# EAGLE design Main_PCB_Sig_only (EAGLE 9.7.0)
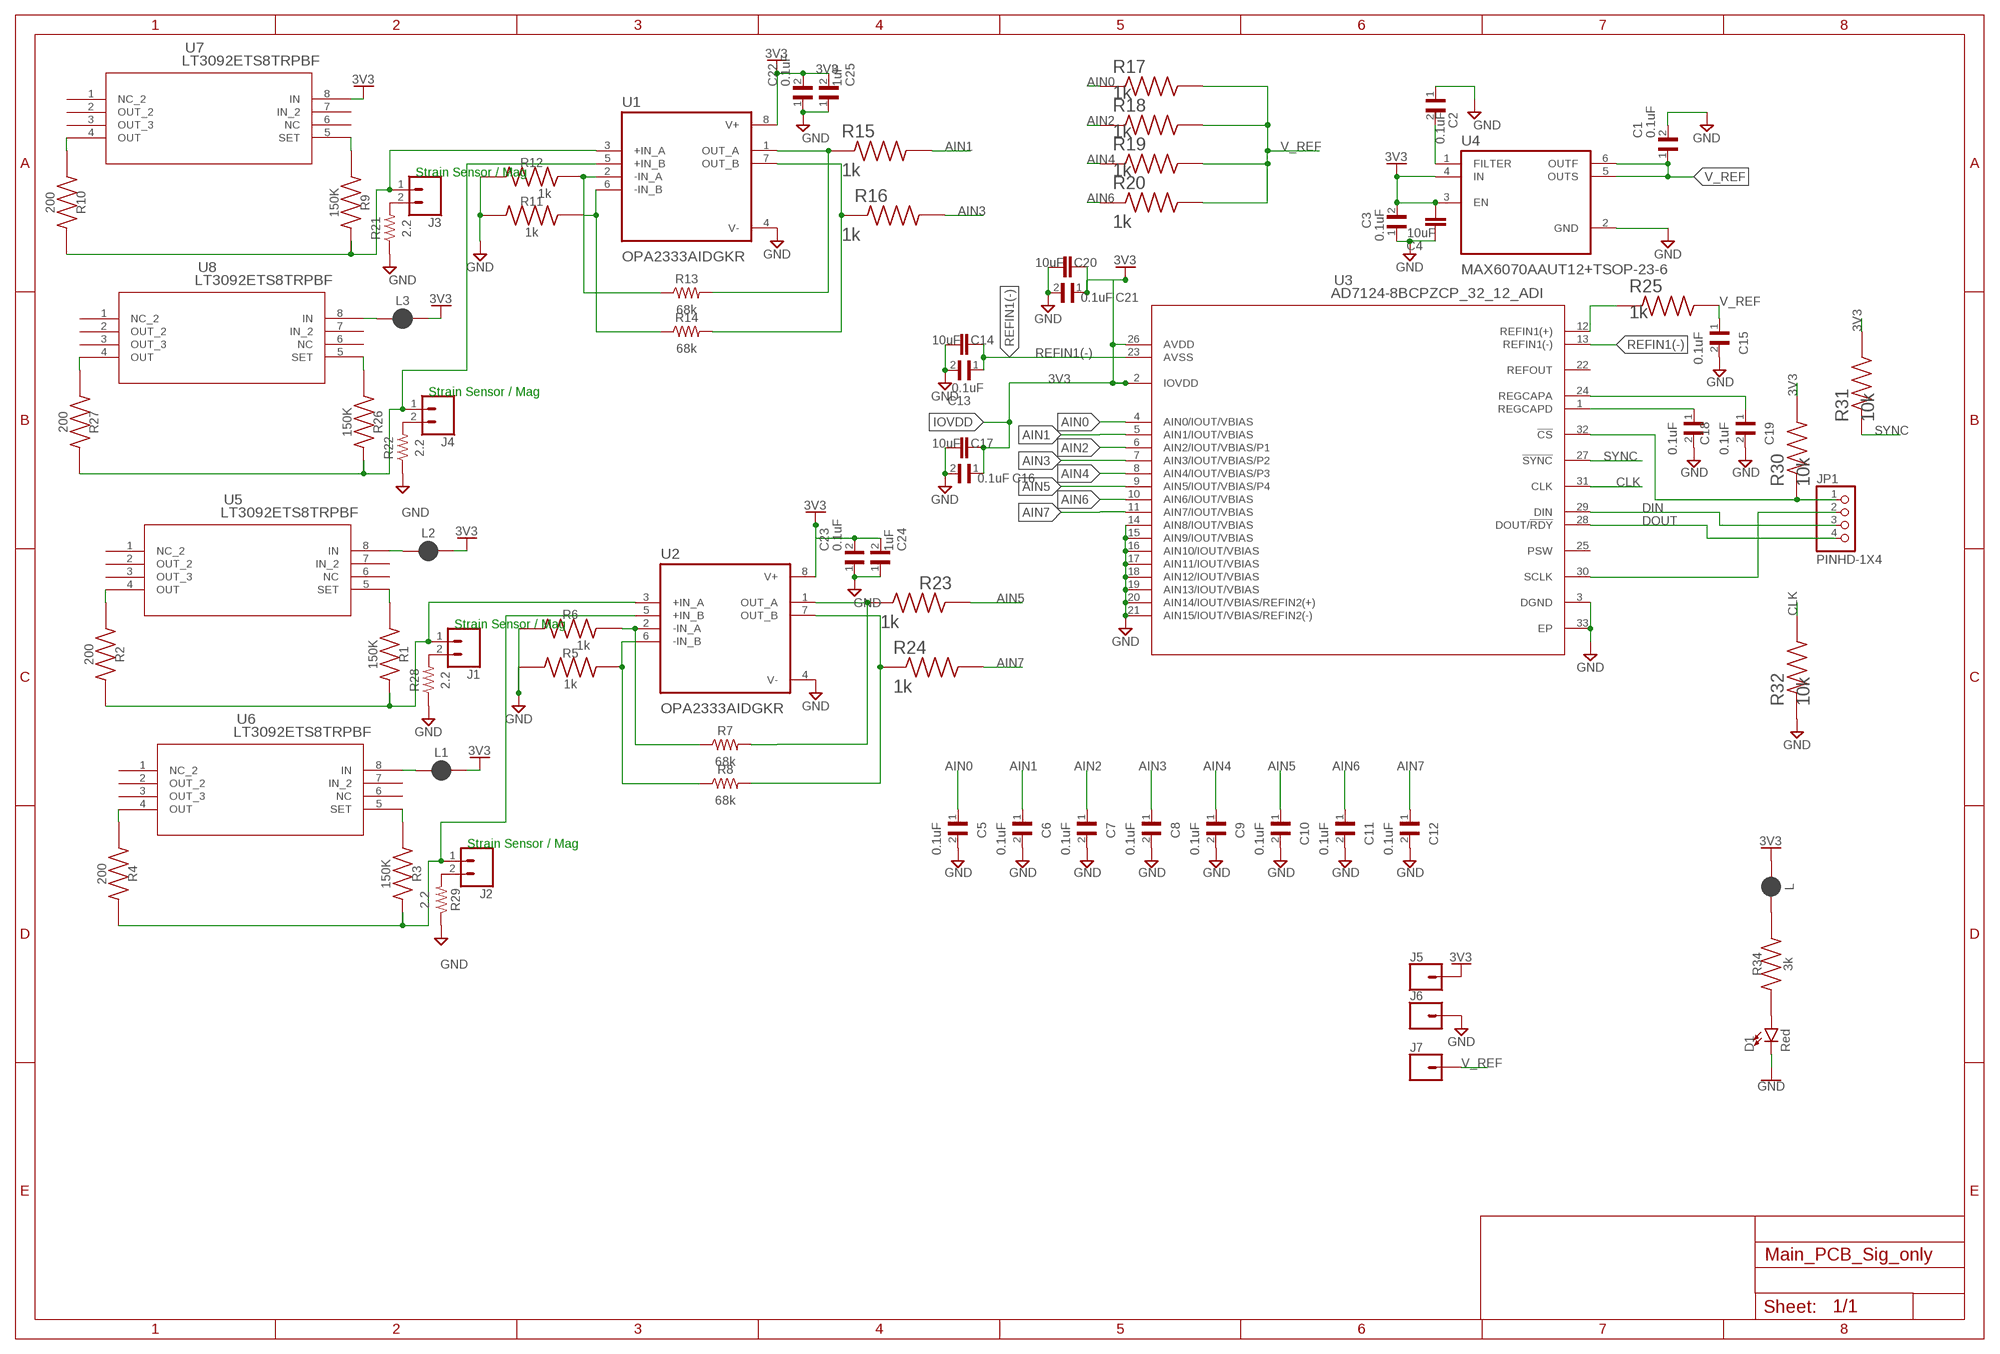
[diagram p0: schematic, sheet 1]

## Parts
C1  0.1uF  0201ZD104KAT2A  [CAPC0603X33N]
C2  0.1uF  0201ZD104KAT2A  [CAPC0603X33N]
C3  0.1uF  0201ZD104KAT2A  [CAPC0603X33N]
C4  10uF  C_CHIP-0402(1005-METRIC)  [CAPC1005X60]
C5  0.1uF  C0603X7S1A104M030BC0201  [CAPC0603X33N]
C6  0.1uF  C0603X7S1A104M030BC0201  [CAPC0603X33N]
C7  0.1uF  C0603X7S1A104M030BC0201  [CAPC0603X33N]
C8  0.1uF  C0603X7S1A104M030BC0201  [CAPC0603X33N]
C9  0.1uF  C0603X7S1A104M030BC0201  [CAPC0603X33N]
C10  0.1uF  C0603X7S1A104M030BC0201  [CAPC0603X33N]
C11  0.1uF  C0603X7S1A104M030BC0201  [CAPC0603X33N]
C12  0.1uF  C0603X7S1A104M030BC0201  [CAPC0603X33N]
C13  0.1uF  0201ZD104KAT2A  [CAPC0603X33N]
C14  10uF  C_CHIP-0402(1005-METRIC)  [CAPC1005X60]
C15  0.1uF  C0603X7S1A104M030BC0201  [CAPC0603X33N]
C16  0.1uF  0201ZD104KAT2A  [CAPC0603X33N]
C17  10uF  C_CHIP-0402(1005-METRIC)  [CAPC1005X60]
C18  0.1uF  C0603X7S1A104M030BC0201  [CAPC0603X33N]
C19  0.1uF  C0603X7S1A104M030BC0201  [CAPC0603X33N]
C20  10uF  C_CHIP-0402(1005-METRIC)  [CAPC1005X60]
C21  0.1uF  0201ZD104KAT2A  [CAPC0603X33N]
C22  0.1uF  0201ZD104KAT2A  [CAPC0603X33N]
C23  0.1uF  0201ZD104KAT2A  [CAPC0603X33N]
C24  1uF  0201ZD104KAT2A  [CAPC0603X33N]
C25  1uF  0201ZD104KAT2A  [CAPC0603X33N]
D1  Red  LED-RED0603  [LED-0603]
J1  CONN_02  [1X02]
J2  CONN_02  [1X02]
J3  CONN_02  [1X02]
J4  CONN_02  [1X02]
J5  CONN_01PTH_LONGPAD  [1X01_LONGPAD]
J6  CONN_01PTH_LONGPAD  [1X01_LONGPAD]
J7  CONN_01PTH_LONGPAD  [1X01_LONGPAD]
JP1  PINHD-1X4  [1X04]
L  JUMPER-SMT_2_NC_PASTE_NO-SILK  [SMT-JUMPER_2_NC_PASTE_NO-SILK]
L1  JUMPER-SMT_2_NC_PASTE_NO-SILK  [SMT-JUMPER_2_NC_PASTE_NO-SILK]
L2  JUMPER-SMT_2_NC_PASTE_NO-SILK  [SMT-JUMPER_2_NC_PASTE_NO-SILK]
L3  JUMPER-SMT_2_NC_PASTE_NO-SILK  [SMT-JUMPER_2_NC_PASTE_NO-SILK]
R1  150K  AC0201FR-0710KL  [RESC0603X26N]
R2  200  AC0201FR-0710KL  [RESC0603X26N]
R3  150K  AC0201FR-0710KL  [RESC0603X26N]
R4  200  AC0201FR-0710KL  [RESC0603X26N]
R5  1k  AC0201FR-0710KL  [RESC0603X26N]
R6  1k  AC0201FR-0710KL  [RESC0603X26N]
R7  68k  R-US_CHIP-0603(1608-METRIC)  [RESC1608X60]
R8  68k  R-US_CHIP-0603(1608-METRIC)  [RESC1608X60]
R9  150K  AC0201FR-0710KL  [RESC0603X26N]
R10  200  AC0201FR-0710KL  [RESC0603X26N]
R11  1k  AC0201FR-0710KL  [RESC0603X26N]
R12  1k  AC0201FR-0710KL  [RESC0603X26N]
R13  68k  R-US_CHIP-0603(1608-METRIC)  [RESC1608X60]
R14  68k  R-US_CHIP-0603(1608-METRIC)  [RESC1608X60]
R15  1k  AC0201FR-0710KL  [RESC0603X26N]
R16  1k  AC0201FR-0710KL  [RESC0603X26N]
R17  1k  AC0201FR-0710KL  [RESC0603X26N]
R18  1k  AC0201FR-0710KL  [RESC0603X26N]
R19  1k  AC0201FR-0710KL  [RESC0603X26N]
R20  1k  AC0201FR-0710KL  [RESC0603X26N]
R21  2.2  R-US_CHIP-0603(1608-METRIC)  [RESC1608X60]
R22  2.2  R-US_CHIP-0603(1608-METRIC)  [RESC1608X60]
R23  1k  AC0201FR-0710KL  [RESC0603X26N]
R24  1k  AC0201FR-0710KL  [RESC0603X26N]
R25  1k  AC0201FR-0710KL  [RESC0603X26N]
R26  150K  AC0201FR-0710KL  [RESC0603X26N]
R27  200  AC0201FR-0710KL  [RESC0603X26N]
R28  2.2  R-US_CHIP-0603(1608-METRIC)  [RESC1608X60]
R29  2.2  R-US_CHIP-0603(1608-METRIC)  [RESC1608X60]
R30  10k  AC0201FR-0710KL  [RESC0603X26N]
R31  10k  AC0201FR-0710KL  [RESC0603X26N]
R32  10k  AC0201FR-0710KL  [RESC0603X26N]
R34  3k  AC0201FR-0710KL  [RESC0603X26N]
U1  OPA2333AIDGKR  [SOP65P490X110-8N]
U2  OPA2333AIDGKR  [SOP65P490X110-8N]
U3  AD7124-8BCPZCP_32_12_ADI  [CP_32_12_ADI]
U4  MAX6070AAUT12+TSOP-23-6  [SOT95P280X145-6N]
U5  LT3092ETS8TRPBF  [TSOT-23_TS8]
U6  LT3092ETS8TRPBF  [TSOT-23_TS8]
U7  LT3092ETS8TRPBF  [TSOT-23_TS8]
U8  LT3092ETS8TRPBF  [TSOT-23_TS8]

## Nets
3V3: C3.2 C4.2 C16.1 C17.1 C20.1 C21.1 C22.2 C23.2 C24.2 C25.2 J5.1 L1.2 L2.2 L3.2 L.1 R30.2 R31.2 U1.8(V+) U2.8(V+) U3.2(IOVDD) U3.26(AVDD) U4.3(EN) U4.4(IN) U7.8(IN)
+IN_A1: J3.1 R9.2 R10.2 U1.3(+IN_A)
+IN_A2: J1.1 R1.2 R2.2 U2.3(+IN_A)
+IN_B1: J4.1 R26.2 R27.2 U1.5(+IN_B)
+IN_B2: J2.1 R3.2 R4.2 U2.5(+IN_B)
-IN_A1: R12.2 R13.1 U1.2(-IN_A)
-IN_A2: R6.2 R7.1 U2.2(-IN_A)
-IN_B1: R11.2 R14.1 U1.6(-IN_B)
-IN_B2: R5.2 R8.1 U2.6(-IN_B)
AIN0: C5.1 R17.1 U3.4(AIN0/IOUT/VBIAS)
AIN1: C6.1 R15.2 U3.5(AIN1/IOUT/VBIAS)
AIN2: C7.1 R18.1 U3.6(AIN2/IOUT/VBIAS/P1)
AIN3: C8.1 R16.2 U3.7(AIN3/IOUT/VBIAS/P2)
AIN4: C9.1 R19.1 U3.8(AIN4/IOUT/VBIAS/P3)
AIN5: C10.1 R23.2 U3.9(AIN5/IOUT/VBIAS/P4)
AIN6: C11.1 R20.1 U3.10(AIN6/IOUT/VBIAS)
AIN7: C12.1 R24.2 U3.11(AIN7/IOUT/VBIAS)
CLK: R32.2 U3.31(CLK)
CS: JP1.1 R30.1 U3.32(!CS)
DIN: JP1.3 U3.29(DIN)
DOUT: JP1.4 U3.28(DOUT/!RDY)
GND: C1.2 C2.1 C3.1 C4.1 C5.2 C6.2 C7.2 C8.2 C9.2 C10.2 C11.2 C12.2 C13.2 C14.2 C15.2 C16.2 C17.2 C18.2 C19.2 C20.2 C21.2 C22.1 C23.1 C24.1 C25.1 D1.C J6.1 R5.1 R6.1 R11.1 R12.1 R21.1 R22.1 R28.1 R29.1 R32.1 U1.4(V-) U2.4(V-) U3.3(DGND) U3.14(AIN8/IOUT/VBIAS) U3.15(AIN9/IOUT/VBIAS) U3.16(AIN10/IOUT/VBIAS) U3.17(AIN11/IOUT/VBIAS) U3.18(AIN12/IOUT/VBIAS) U3.19(AIN13/IOUT/VBIAS) U3.20(AIN14/IOUT/VBIAS/REFIN2(+)) U3.21(AIN15/IOUT/VBIAS/REFIN2(-)) U3.33(EP) U4.2(GND)
I_OUT1: R10.1 U7.4(OUT)
I_OUT2: R27.1 U8.4(OUT)
I_OUT3: R2.1 U5.4(OUT)
I_OUT4: R4.1 U6.4(OUT)
I_SET1: R9.1 U7.5(SET)
I_SET2: R26.1 U8.5(SET)
I_SET3: R1.1 U5.5(SET)
I_SET4: R3.1 U6.5(SET)
N$1: L1.1 U6.8(IN)
N$17: C2.2 U4.1(FILTER)
N$29: J3.2 R21.2
N$34: J4.2 R22.2
N$35: J1.2 R28.2
N$36: J2.2 R29.2
N$38: L.2 R34.2
N$39: D1.A R34.1
N$40: L2.1 U5.8(IN)
N$41: L3.1 U8.8(IN)
OUT_A1: R13.2 R15.1 U1.1(OUT_A)
OUT_A2: R7.2 R23.1 U2.1(OUT_A)
OUT_B1: R14.2 R16.1 U1.7(OUT_B)
OUT_B2: R8.2 R24.1 U2.7(OUT_B)
REFIN1(+): R25.1 U3.12(REFIN1(+))
REFIN1(-): C13.1 C14.1 U3.13(REFIN1(-)) U3.23(AVSS)
REGCAPA: C19.1 U3.24(REGCAPA)
REGCAPD: C18.1 U3.1(REGCAPD)
SCLK: JP1.2 U3.30(SCLK)
SYNC: R31.1 U3.27(!SYNC)
V_REF: C1.1 C15.1 J7.1 R17.2 R18.2 R19.2 R20.2 R25.2 U4.5(OUTS) U4.6(OUTF)
Unconnected: U3.22(REFOUT) U3.25(PSW) U5.1(NC_2) U5.2(OUT_2) U5.3(OUT_3) U5.6(NC) U5.7(IN_2) U6.1(NC_2) U6.2(OUT_2) U6.3(OUT_3) U6.6(NC) U6.7(IN_2) U7.1(NC_2) U7.2(OUT_2) U7.3(OUT_3) U7.6(NC) U7.7(IN_2) U8.1(NC_2) U8.2(OUT_2) U8.3(OUT_3) U8.6(NC) U8.7(IN_2)

## Notes on the sheet
- Strain Sensor / Mag
- Strain Sensor / Mag
- Strain Sensor / Mag
- Strain Sensor / Mag

## Library data of the parts
C1-C3 C13 C16 C21-C25 = Cap 0201ZD104KAT2A:0201ZD104KAT2A: Check availability <https://pricing.snapeda.com/parts/0201ZD104KAT2A/AVX/view-part?ref=eda>; AVAILABILITY: In Stock; CHECK_PRICES: https://www.snapeda.com/parts/0201ZD104KAT2A/AVX/view-part/?ref=eda; DESCRIPTION: 0.1 µF ±10% 10V Ceramic Capacitor X5R 0201 (0603 Metric); MF: AVX; MP: 0201ZD104KAT2A; PACKAGE: 0603 AVX; PRICE: None; SNAPEDA_LINK: https://www.snapeda.com/parts/0201ZD104KAT2A/AVX/view-part/?ref=snap
C4 C14 C17 C20 = Capacitor:C: Capacitor - Generic; CATEGORY: Capacitor
C5-C12 C15 C18 C19 = Cap 0201:C0603X7S1A104M030BC: Check availability <https://pricing.snapeda.com/parts/C0603X7S1A104M030BC/TDK/view-part?ref=eda>; AVAILABILITY: In Stock; CHECK_PRICES: https://www.snapeda.com/parts/C0603X7S1A104M030BC/TDK/view-part/?ref=eda; DESCRIPTION: 0.1 µF ±20% 10V Ceramic Capacitor X7S 0201 (0603 Metric); MF: TDK; MP: C0603X7S1A104M030BC; PACKAGE: 0603 Taiyo Yuden; PRICE: None; SNAPEDA_LINK: https://www.snapeda.com/parts/C0603X7S1A104M030BC/TDK/view-part/?ref=snap
D1 = SparkFun-LED:LED-RED: Red SMD LED Used in manufacturing of most products at SparkFun Packages: 0603 - KB - KingBright (DIO-17976) SMD 0603 package [Datasheet] <https://www.kingbrightusa.com/images/catalog/SPEC/APT1608SURCK.pdf> 0603 - (DIO-00819, has gone EOL) SMD 0603 package 0603 SMART - SMD 0603 SMART package ( more efficient and expensive)[Product Link] <http://www.osram-os.com/Graphics/XPic2/00077099_0.pdf> 1206 - SMD1206 package [Product Link] <https://www.sparkfun.com/datasheets/DevTools/LilyPad/Q150OVS4.pdff> SparkFun Products: Pro Mini 328 -5V <https://www.sparkfun.com/products/821> RedBoard <https://www.sparkfun.com/products/12757> IOIO-OTG <https://www.sparkfun.com/products/13613>; PROD_ID: DIO-00819
J1-J4 = SparkFun-Connectors:CONN_02: Multi connection point. Often used as Generic Header-pin footprint for 0.1 inch spaced/style header connections On any of the 0.1 inch spaced packages, you can populate with these: Break Away Headers - Straight <https://www.sparkfun.com/products/116> (PRT-00116) Break Away Male Headers - Right Angle <https://www.sparkfun.com/products/553> (PRT-00553) Female Headers <https://www.sparkfun.com/products/115> (PRT-00115) Break Away Headers - Machine Pin <https://www.sparkfun.com/products/117> (PRT-00117) Break Away Female Headers - Swiss Machine Pin <https://www.sparkfun.com/products/743> (PRT-00743) For SCREWTERMINALS and SPRING TERMINALS visit here: Screw Terimnals on SparkFun.com <https://www.sparkfun.com/search/results?term=Screw+Terminals> (5mm/3.5mm/2.54mm spacing) This device is also useful as a general connection point to wire up your design to another part of your project. Our various solder wires solder well into these plated through hole pads. Hook-Up Wire - Assortment (Stranded, 22 AWG) <https://www.sparkfun.com/products/11375> (PRT-11375) Hook-Up Wire - Assortment (Solid Core, 22 AWG) <https://www.sparkfun.com/products/11367> (PRT-11367) View the entire wire category on our website here <https://www.sparkfun.com/categories/141> Special notes: Molex polarized connector foot print use with: PRT-08233 with associated crimp pins and housings. 2.54_SCREWTERM for use with PRT-10571. 3.5mm Screw Terminal footprints for PRT-08084 5mm Screw Terminal footprints for use with PRT-08432
J5-J7 = SparkFun-Connectors:CONN_01: Single connection point. Often used as Generic Header-pin footprint for 0.1 inch spaced/style header connections On any of the 0.1 inch spaced packages, you can populate with these: Break Away Headers - Straight <https://www.sparkfun.com/products/116> (PRT-00116) Break Away Male Headers - Right Angle <https://www.sparkfun.com/products/553> (PRT-00553) Female Headers <https://www.sparkfun.com/products/115> (PRT-00115) Break Away Headers - Machine Pin <https://www.sparkfun.com/products/117> (PRT-00117) Break Away Female Headers - Swiss Machine Pin <https://www.sparkfun.com/products/743> (PRT-00743) This device is also useful as a general connection point to wire up your design to another part of your project. Our various solder wires solder well into these plated through hole pads. Hook-Up Wire - Assortment (Stranded, 22 AWG) <https://www.sparkfun.com/products/11375> (PRT-11375) Hook-Up Wire - Assortment (Solid Core, 22 AWG) <https://www.sparkfun.com/products/11367> (PRT-11367) View the entire wire category on our website here <https://www.sparkfun.com/categories/141> Special notes: SMTSO-256-ET is a "flush mount" nut for a 4-40 screw. We mostly use this on specialty testbeds; it is a nice way to connect hardware to your PCB at an adjustable hieght. Also note, the SNAP packages are for using a snappable style connector. We sell a baggie of snaps and they are also used on two LilyPad designs: Snap Assortment - 30 pack (male and female) <https://www.sparkfun.com/products/11347> (DEV-11347) LilyPad Arduino SimpleSnap <https://www.sparkfun.com/products/10941> (DEV-10941) LilyPad SimpleSnap Protoboard <https://www.sparkfun.com/products/10940> (DEV-10940)
JP1 = Connector:PINHD-1X4: PIN HEADER; CATEGORY: Headers; DESCRIPTION: Header, Straight, 4 Position; MANUFACTURER: Generic; MPN: Generic; OPERATING_TEMPERATURE: Generic; PART_STATUS: Active; PITCH: 0.100" (2.54mm); ROHS_COMPLIANCE: Generic; SERIES: Generic; SUB-CATEGORY: Headers, Male Pins; TYPE: Board to Board or Cable, Unshrouded, Through Hole, Straight
L L1-L3 = SparkFun-Jumpers-KinGlove-Addr-Custom:JUMPER-SMT_2_NC_PASTE: Normally closed solder jumper This jumper has an aperture in the stencil to allow solder paste to bridge the split in the wire so it's normally closed (NC). Wick off the solder to open the connection. Reapply solder to reclose the connection.
R1-R6 R9-R12 R15-R20 R23-R27 R30-R32 R34 = Resistor 0201 (0603 Metric) AC0201FR-0710KL:AC0201FR-0710KL: Check availability <https://pricing.snapeda.com/parts/AC0201FR-0710KL/Yageo/view-part?ref=eda>; AVAILABILITY: In Stock; CHECK_PRICES: https://www.snapeda.com/parts/AC0201FR-0710KL/Yageo/view-part/?ref=eda; DESCRIPTION: 10 kOhms ±1% 0.05W, 1/20W Chip Resistor 0201 (0603 Metric) Automotive AEC-Q200, Moisture Resistant Thick Film; MF: Yageo; MP: AC0201FR-0710KL; PACKAGE: SMD-2 Yageo; PRICE: None; SNAPEDA_LINK: https://www.snapeda.com/parts/AC0201FR-0710KL/Yageo/view-part/?ref=snap
R7 R8 R13 R14 R21 R22 R28 R29 = Resistor:R-US: Resistor Fixed - ANSI; CATEGORY: Resistor; SUB-CATEGORY: Fixed
U1 U2 = OPA2333AIDGKR:OPA2333AIDGKR: Check availability <https://pricing.snapeda.com/parts/OPA2333AIDGKR/Texas%20Instruments/view-part?ref=eda>; AVAILABILITY: In Stock; CHECK_PRICES: https://www.snapeda.com/parts/OPA2333AIDGKR/Texas+Instruments/view-part/?ref=eda; DESCRIPTION: 1.8-V, 17-µA, two-channel, micropower zero-drift CMOS operational amplifier; MF: Texas Instruments; MP: OPA2333AIDGKR; PACKAGE: VSSOP-8 Texas Instruments; PRICE: None; SNAPEDA_LINK: https://www.snapeda.com/parts/OPA2333AIDGKR/Texas+Instruments/view-part/?ref=snap
U3 = 2025-08-13_20-53-36_Library:AD7124-8BCPZ; COPYRIGHT: Copyright (C) 2025 Ultra Librarian. All rights reserved.; DATASHEET: https://www.analog.com/media/en/technical-documentation/data-sheets/ad7124-8.pdf; DESCRIPTION: 8-Channel, Low Noise, Low Power, 24-Bit, Sigma-Delta ADC with PGA and Reference; MANUFACTURER_NAME: Analog Devices Inc; MANUFACTURER_PART_NUMBER: AD7124-8BCPZ
U4 = MAX6070AAUT12_T:MAX6070AAUT12+T: Check availability <https://pricing.snapeda.com/parts/MAX6070AAUT12%2BT/Maxim%20Integrated%20Products/view-part?ref=eda>; AVAILABILITY: In Stock; CHECK_PRICES: https://www.snapeda.com/parts/MAX6070AAUT12+T/Maxim+Integrated/view-part/?ref=eda; DESCRIPTION: Series Voltage Reference IC Fixed 1.25V V ±0.04% 10 mA SOT-23-6; MF: Maxim Integrated Products; MP: MAX6070AAUT12+T; PACKAGE: SOT-23-6 Maxim Integrated; PRICE: None; SNAPEDA_LINK: https://www.snapeda.com/parts/MAX6070AAUT12+T/Maxim+Integrated/view-part/?ref=snap
U5-U8 = LT3092ETS8TRPBF:LT3092ETS8TRPBF: Check availability <https://pricing.snapeda.com/parts/LT3092ETS8%23TRPBF/Analog%20Devices/view-part?ref=eda>; AVAILABILITY: In Stock; CHECK_PRICES: https://www.snapeda.com/parts/LT3092ETS8%23TRPBF/Analog+Devices/view-part/?ref=eda; DESCRIPTION: 200mA 2-Terminal Programmable Current Source; MF: Analog Devices; MP: LT3092ETS8#TRPBF; PACKAGE: TSOT-23 Linear Technology; PRICE: None; SNAPEDA_LINK: https://www.snapeda.com/parts/LT3092ETS8%23TRPBF/Analog+Devices/view-part/?ref=snap

## Board
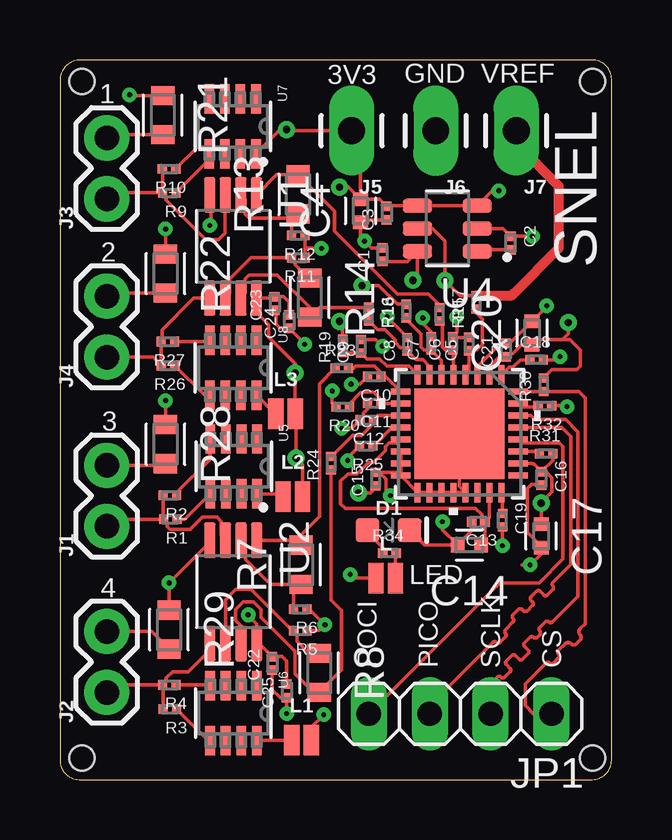
[diagram p1: board, top side]
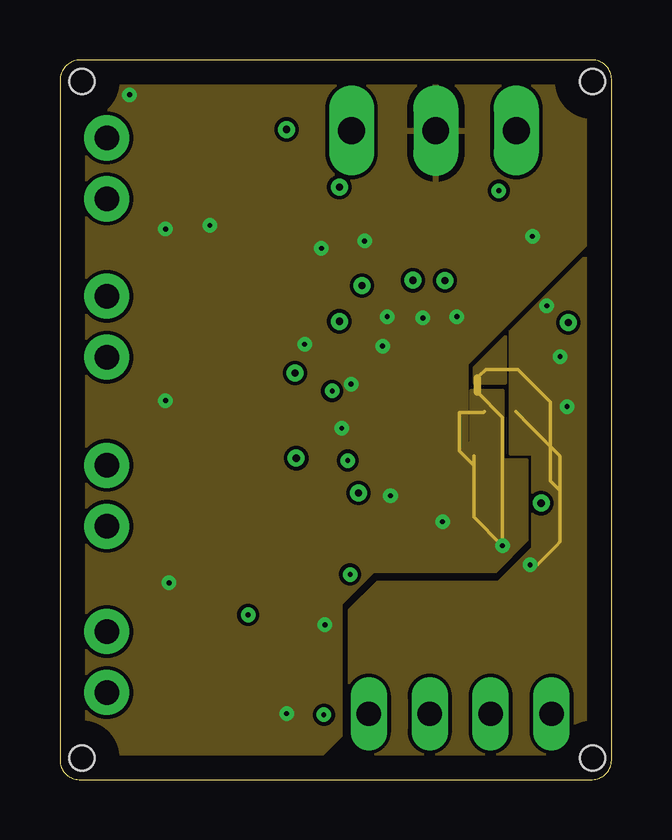
[diagram p2: board, inner layer Route2]
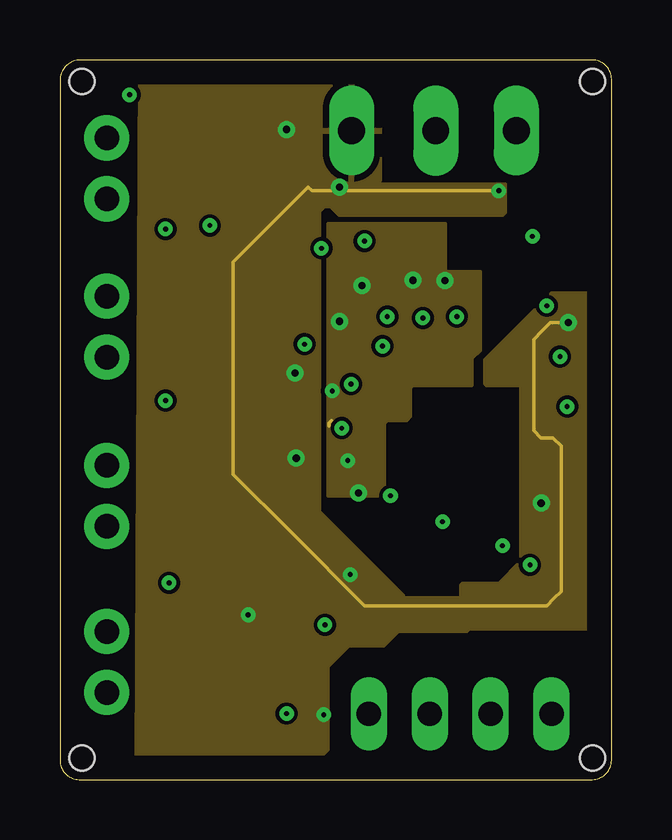
[diagram p3: board, inner layer Route15]
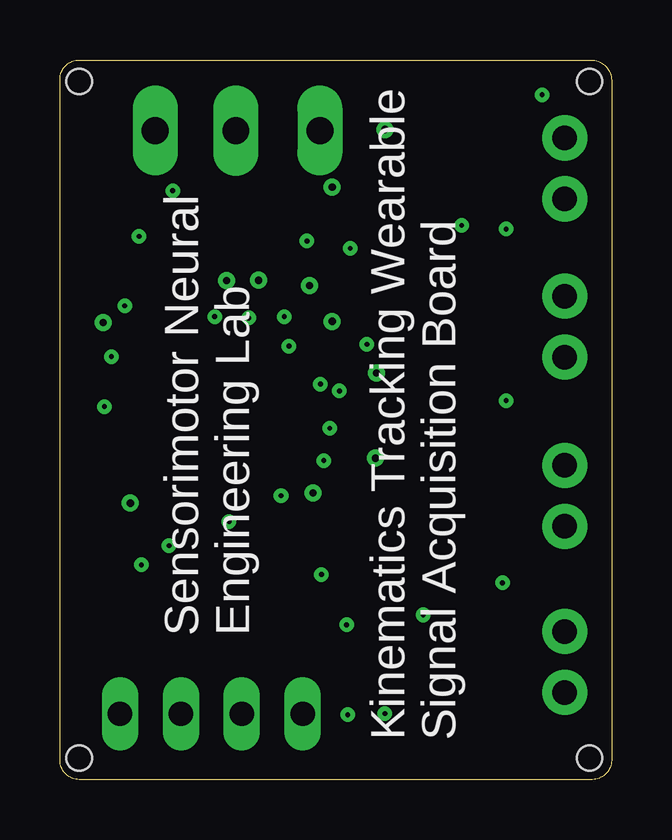
[diagram p4: board, bottom side, seen from below]

Size 23 x 30 mm. Coordinates in mm from the lower left corner, seen from the top.
Outline: 0,1.25 0,0.8 arc90 0.8,0 1.15,0 2.15,0 2.25,0 22.2,0 arc90 23,0.8 23,0.95 23,27.2 23,28.45 23,29.2 arc90 22.2,30 21.9,30 1.3,30 0.85,30 arc90 0,29.15 0,28.85 0,28.8 0,1.25
Copper layers (1+2*15+16): Top 0.035mm / dielectric 1.5mm / Route2 0.035mm / dielectric 0.15mm / Route15 0.035mm / dielectric 0.2mm / Bottom 0.035mm
Design rules "Fusion Electronics Design Rules *": minimum track width 6mil, minimum drill 0.15mm, track to track 6mil, track to pad 6mil, pad to pad 6mil, via to via 6mil, smd to smd 6mil, copper to edge 40mil, drill to drill 6mil, minimum pad ring 10mil, minimum via ring 8mil, stop-mask expansion 4mil, vias tented up to drill 9999mil, thermal gap 10mil
Holes 1.05 mm at 22.2,0.9 0.93,29.1 22.2,29.1 0.93,0.9

### Footprints (pad centres in the part's own frame; a part is rotated, then mirrored left to right if it is on the bottom)
CAPC0603X33N = smd 0.4 x 0.42: 1 -0.28,0; 2 0.28,0
CAPC1005X60 = smd 0.56 x 0.629: 1 -0.485,0; 2 0.485,0
CAPC0603X33N' = smd 0.38 x 0.4: 1 -0.281,0; 2 0.281,0
LED-0603 = smd 1 x 1: A -0.877,0; C 0.877,0
1X02 = drill 1.016 pad 1.88: 1 0,0; 2 2.54,0
1X01_LONGPAD = drill 1.118 pad 1.88 long: 1 0,0
1X04 = drill 1.016 long: 1 -3.81,0; 2 -1.27,0; 3 1.27,0; 4 3.81,0
SMT-JUMPER_2_NC_PASTE_NO-SILK = smd 0.635 x 1.27: 1 -0.406,0; 2 0.406,0
RESC0603X26N = smd 0.38 x 0.4: 1 -0.281,0; 2 0.281,0
RESC1608X60 = smd 0.799 x 0.974: 1 -0.815,0; 2 0.815,0
SOP65P490X110-8N = smd 1.47 x 0.48: 1 -2.15,0.975; 2 -2.15,0.325; 3 -2.15,-0.325; 4 -2.15,-0.975; 5 2.15,-0.975; 6 2.15,-0.325; 7 2.15,0.325; 8 2.15,0.975
CP_32_12_ADI = smd 0.813 x 0.254: 1 -2.451,1.75; 2 -2.451,1.25; 3 -2.451,0.75; 4 -2.451,0.25; 5 -2.451,-0.25; 6 -2.451,-0.75; 7 -2.451,-1.25; 8 -2.451,-1.75; 17 2.451,-1.75; 18 2.451,-1.25; 19 2.451,-0.75; 20 2.451,-0.25; 21 2.451,0.25; 22 2.451,0.75; 23 2.451,1.25; 24 2.451,1.75 | smd 0.254 x 0.813: 9 -1.75,-2.451; 10 -1.25,-2.451; 11 -0.75,-2.451; 12 -0.25,-2.451; 13 0.25,-2.451; 14 0.75,-2.451; 15 1.25,-2.451; 16 1.75,-2.451; 25 1.75,2.451; 26 1.25,2.451; 27 0.75,2.451; 28 0.25,2.451; 29 -0.25,2.451; 30 -0.75,2.451; 31 -1.25,2.451; 32 -1.75,2.451 | smd 3.759 x 3.759: 33 0,0
SOT95P280X145-6N = smd 1.22 x 0.6: 1 -1.245,0.95; 2 -1.245,0; 3 -1.245,-0.95; 4 1.245,-0.95; 5 1.245,0; 6 1.245,0.95
TSOT-23_TS8 = smd 1.219 x 0.406: 1 -1.143,0.975; 2 -1.143,0.325; 3 -1.143,-0.325; 4 -1.143,-0.975; 5 1.143,-0.975; 6 1.143,-0.325; 7 1.143,0.325; 8 1.143,0.975

### Placement (x,y rotation side)
C1  13.44,21.88 90 top
C2  18.79,22.37 270 top
C3  13.62,23.61 90 top
C4  12.53,23.71 90 top
C5  0.1uF  [CAPC0603X33N']  17.05,18.16 90 top
C6  0.1uF  [CAPC0603X33N']  16.38,18.18 90 top
C7  0.1uF  [CAPC0603X33N']  15.48,18.19 90 top
C8  0.1uF  [CAPC0603X33N']  14.48,18.15 90 top
C9  0.1uF  [CAPC0603X33N']  12.55,18.07 90 top
C10  0.1uF  [CAPC0603X33N']  13.11,16.8 180 top
C11  0.1uF  [CAPC0603X33N']  13.1,15.7 180 top
C12  0.1uF  [CAPC0603X33N']  12.8,14.99 180 top
C13  17.44,10.74 180 top
C14  17.07,9.78 180 top
C15  0.1uF  [CAPC0603X33N']  13.15,12.52 90 top
C16  20.08,12.55 270 top
C17  20.06,10.16 270 top
C18  0.1uF  [CAPC0603X33N']  19.88,17.5 0 top
C19  0.1uF  [CAPC0603X33N']  18.45,10.81 270 top
C20  19.68,18.62 90 top
C21  18.59,17.91 90 top
C22  8.85,4.85 90 top
C23  8.95,19.85 90 top
C24  9.55,19.1 90 top
C25  9.45,3.7 90 top
D1  13.7,10.39 0 top
J1  1.96,10.56 90 top
J2  1.96,3.63 90 top
J3  1.96,24.21 90 top
J4  1.96,17.61 90 top
J5  12.16,27.05 180 top
J6  15.67,27.05 180 top
J7  19.03,27.05 180 top
JP1  16.69,2.74 180 top
L  13.58,8.4 0 top
L1  10.07,1.65 0 top
L2  9.71,11.8 0 top
L3  9.41,15.25 0 top
R1  4.6,10.85 180 top
R2  4.59,11.85 180 top
R3  4.58,2.93 180 top
R4  4.57,3.95 180 top
R5  10.03,6.21 180 top
R6  10.02,7.11 180 top
R7  10.05,8.95 90 top
R8  10.81,4.45 270 top
R9  4.56,24.46 180 top
R10  4.55,25.46 180 top
R11  9.94,21.76 180 top
R12  9.93,22.68 180 top
R13  9.93,24.4 90 top
R14  10.42,20.1 270 top
R15  15.83,19.39 270 top
R16  12.88,19.41 270 top
R17  17.35,19.9 90 top
R18  14.43,19.53 90 top
R19  11.79,18.08 90 top
R20  11.79,15.54 180 top
R21  4.29,27.7 270 top
R22  4.4,21.09 270 top
R23  11.75,17.15 0 top
R24  11.3,13.18 90 top
R25  12.77,13.91 180 top
R26  4.51,17.26 180 top
R27  4.5,18.26 180 top
R28  4.4,13.98 270 top
R29  4.55,6.25 270 top
R30  20.16,16.46 90 top
R31  20.27,13.59 0 top
R32  20.22,15.59 180 top
R34  13.74,9.44 0 top
U1  7.22,22.22 270 top
U2  7.23,7.82 270 top
U3  16.66,14.42 270 top
U4  16.15,22.97 180 top
U5  7.25,13.06 270 top
U6  7.23,2.77 270 top
U7  7.2,27.23 270 top
U8  7.22,17.17 270 top

### Tracks (layer width: path | path; a pad name or v marks a point on that pad's centre or on a via)
3V3  (via drill 0.2, 0.3)
  Top 0.152: U3.2 17.91,17.23 18.19,17.51 18.31,17.63 C21.1 18.72,17.76 18.89,17.76 19.27,18.13 C20.1 19.9,18.35 20.75,18.35 20.95,18.35 | C16.1 19.75,13.16 19.7,13.16 19.7,13.17 U3.26 | R30.2 20.52,17.1 21.55,17.1 21.7,17.25 21.7,17.6 21.7,17.9 21.25,18.35 20.95,18.35 | 20.95,18.35 21.2,18.6 v21.2,19.05 | C17.1 v20.07,11.53 20.52,11.98 20.52,12.57 20.25,12.83 C16.1 | 9.5,27.1 9.55,27.05 J5.1 12.53,26.68 C4.2 | 9.5,27.1 v9.45,27.1 | U7.8 9.19,27.1 9.5,27.1 | C4.2 13.31,24.2 C3.2 13.65,23.92 U4.4 U4.3 18.03,24.55 v18.3,24.55 | C4.2 12.03,24.7 v11.65,24.7 | L2.2 10.12,13.13 v9.85,13.4 9.85,15.21 L3.2 9.8,15.27 v9.8,16.95 9.8,17.35 8.7,18.45 8.7,18.85 8.7,18.97 8.19,19.47 U1.8 8.89,20.07 C23.2 9.32,20.13 9.5,19.95 9.55,19.9 C24.2 | v7.85,6.87 v7.85,6.85 8.2,6.5 U2.8 8.31,5.67 C22.2 9.27,5.13 9.4,5 9.45,4.95 C25.2 | L1.2 10.48,2.17 v11,2.7 | L.1 12.25,8.4 v12.1,8.55 | C16.1 20.55,13.3 R31.2
  Route15 0.152: v18.3,24.55 10.5,24.55 10.35,24.7 7.22,21.57 7.22,12.72 9.65,10.3 12.7,7.25 13.55,7.25 20.3,7.25 20.6,7.55 20.9,7.85 20.9,13.9 20.55,14.25 20.05,14.25 19.75,14.55 19.75,16.85 19.75,18.35 20.1,18.7 20.45,19.05 v21.2,19.05
  pour Route15: 18.57,24.82 18.57,24.82 13.38,24.82 13.36,24.84 13.34,24.86 13.32,24.88 13.32,24.92 13.34,24.94 13.37,24.98 13.37,29.72 3.33,29.72 3.18,0.73 10.67,0.73 11.17,1.23 11.17,4.67 11.19,4.69 12.06,5.56 12.08,5.58 13.52,5.58 14.32,6.38 14.32,7.67 10.84,11.16 10.82,11.18 10.82,23.67 10.84,23.69 11.01,23.86 11.03,23.88 11.27,23.88 11.29,23.86 11.63,23.53 18.47,23.53 18.57,23.63
  pour Route15: 19.21,9.11 18.29,8.19 18.27,8.17 16.78,8.17 16.73,8.12 16.73,6.28 21.97,6.28 21.97,20.27 20.48,20.27 17.73,17.52 17.73,16.48 17.78,16.43 19.17,16.43 19.19,16.41 19.21,16.39 19.23,16.37 19.23,9.13
  pour Route15: 14.03,6.18 16.97,6.18 17.02,6.23 17.02,7.52 16.97,7.57 14.03,7.57
+IN_A1
  Top 0.152: R10.2 R9.2 | R9.2 2.21,24.46 J3.1 | R9.2 4.42,24.32 4.42,24.16 6.07,22.52 6.62,22.52 6.89,22.79 U1.3
+IN_A2
  Top 0.152: J1.1 2.25,10.85 4.3,10.85 | 4.3,10.85 R1.2 4.46,10.71 4.46,10.55 4.6,10.42 5.44,10.42 5.95,10.94 6.55,10.94 6.72,10.77 6.72,10.16 U2.3 | R2.2 R1.2 4.3,10.85
+IN_B1
  Top 0.152: J4.1 3.88,17.61 R26.2 | R26.2 | R26.2 R27.2 4.25,18.29 4.25,18.75 5.57,20.07 U1.5
+IN_B2
  Top 0.152: J2.1 2.27,3.95 R4.2 | R4.2 R3.2 | R4.2 4.43,4.09 4.43,4.25 4.69,4.5 5.35,4.5 6.25,5.4 U2.5
-IN_A1
  Top 0.152: U1.2 7.72,24.19 7.72,23.58 7.89,23.41 9.93,23.41 R13.1 9.65,23.31 R12.2
-IN_A2
  Top 0.152: R6.2 9.74,7.83 R7.1 8.78,8.14 7.73,9.18 7.73,9.79 U2.2
-IN_B1
  Top 0.152: 7.07,20.26 U1.6 7.07,20.26 | 7.07,20.26 7.07,20.87 7.97,21.76 R11.2 9.8,21.62 9.8,21.46 10.36,20.91 R14.1
-IN_B2
  Top 0.152: U2.6 6.9,7.5 7.33,7.93 7.97,7.93 9.69,6.21 R5.2 9.89,6.07 9.89,5.77 10.39,5.26 R8.1
AIN0
  Top 0.152: U3.4 17.05,17.02 C5.1 17.09,17.92 17.39,17.92 17.61,18.14 17.61,19.21 17.35,19.47 R17.1 17.35,19.45
AIN1
  Top 0.152: U3.5 16.41,17.87 C6.1 16.09,17.9 16.08,17.9 15.95,18.03 15.95,18.99 R15.2
AIN2
  Top 0.152: U3.6 15.91,17.47 C7.1 15.18,17.9 15.05,18.04 15.05,18.58 14.43,19.19 R18.1
AIN3
  Top 0.152: U3.7 15.41,17.23 15.13,17.51 14.85,17.51 C8.1 14.34,18.01 14.19,18.01 13.98,18.22 13.98,18.33 13.54,18.77 13.24,18.77 R16.2
AIN4
  Top 0.152: R19.1 11.8,17.79 C9.1 12.8,17.54 13.33,17.54 13.64,17.23 14.55,17.23 U3.8
AIN5
  Top 0.152: 13.55,16.8 C10.1 | 13.55,16.8 13.58,16.8 U3.9 | R23.2 12.25,17.15 12.33,17.23 13.12,17.23 13.55,16.8
AIN6
  Top 0.152: U3.10 13.41,15.67 C11.1 13.38,15.85 13.08,16.15 12.65,16.15 12.63,16.13 12.53,16.13 12.07,15.66 R20.1
AIN7
  Top 0.152: 12.97,14.9 13.24,15.17 U3.11 | 12.97,14.9 13.06,14.99 | 13.06,14.99 C12.1 13.06,14.99 | 12.97,14.9 13.06,14.99 | 12.97,14.9 12.97,14.73 12.58,14.34 12.2,14.34 11.33,13.46 R24.2
CLK
  Top 0.152: R32.2 19.88,15.53 19.26,15.53 U3.31
CS
  Top 0.152: U3.32 R30.1 21.63,16.18 21.91,15.9 21.91,6.5 21.68,6.27 arc90 21.68,6.04 arc-90 21.68,5.81 21.54,5.66 arc-90 21.3,5.66 arc90 21.07,5.66 20.79,5.38 arc90 20.79,5.23 arc-90 20.79,5.08 20.57,4.85 arc-90 20.41,4.85 arc90 20.26,4.85 19.4,3.99 19.4,3.09 19.75,2.74 JP1.1
DIN
  Top 0.152: U3.29 20.93,14.67 21.3,14.3 21.3,8.97 20.55,8.22 arc90 20.55,8.07 arc-90 20.55,7.92 20.33,7.69 arc-90 20.17,7.69 20.02,7.85 arc90 19.87,7.85 19.64,7.62 arc90 19.64,7.47 19.7,7.41 arc-90 19.7,7.26 19.48,7.03 arc-90 19.33,7.03 19.27,7.09 arc90 19.11,7.09 18.89,6.87 arc90 18.89,6.71 arc-90 18.89,6.56 18.58,6.25 arc90 18.58,6.1 arc-90 18.58,5.94 18.35,5.72 arc-90 18.2,5.72 arc90 18.05,5.72 15.42,3.09 JP1.3
DOUT
  Top 0.152: U3.28 19.25,14.03 20.82,14.03 20.97,13.88 20.97,9.2 19.98,8.21 18.34,8.21 JP1.4
GND  (via drill 0.2)
  Top 0.152: U3.14 U3.15 U3.16 | U3.16 U3.17 U3.18 U3.19 U3.20 U3.21 | C5.2 16.41,18.44 C6.2 16.55,18.64 v16.55,19.3 | C7.2 15.48,18.67 15.13,19.02 v15.13,19.24 | C8.2 13.65,19.26 v13.65,19.3 | 12.7,18.35 C9.2 13.15,18.35 13.43,18.07 v13.45,18.07 | C11.2 12.82,15.44 12.66,15.29 12.66,15.13 C12.2 12.18,14.65 v11.75,14.65 | C13.2 17.16,10.36 C14.2 | C14.2 15.95,10.41 v15.95,10.75 | C18.2 20.72,17.5 v20.85,17.63 | v21.15,15.55 21.11,15.59 R32.1 | C16.2 20.05,12.3 19.66,12.3 19.48,12.13 19.48,10.31 20.07,9.72 C17.2 | C17.2 | C14.2 15.19,9.78 D1.C | v13.78,11.83 13.58,12.03 13.58,12.52 13.31,12.8 13.2,12.8 | C15.2 13.2,12.8 | 13.2,12.8 14.08,12.8 U3.16 | R29.1 v4.55,8.2 6.25,9.9 U2.4 | R28.1 v4.4,15.8 | R22.1 v4.4,22.95 | R21.1 2.94,28.52 v2.9,28.55 | U1.4 6.3,24.32 6.3,23.1 v6.25,23.1 | R5.1 10.81,6.21 v11.05,6.45 10.39,7.11 R6.1 | R11.1 10.21,22.15 | 10.21,22.15 R12.1 | 10.21,22.15 v10.9,22.15 | C1.2 12.99,22.16 v12.7,22.45 12.53,22.62 C4.1 12.63,23.33 C3.1 | U4.2 18.47,22.97 C2.1 v19.7,22.65 | U3.3 17.41,17.23 18.24,18.06 18.46,18.06 C21.2 18.77,18.19 C20.2 20.3,19.72 v20.3,19.75 | U3.21 16.85,12.03 | U3.21 16.66,12.22 U3.33 | C19.2 v18.45,9.75 | C17.2 20.07,9.41 v19.6,8.95 19.25,8.95 | C10.2 12.51,16.48 v12.14,16.48 | C23.1 9,19.52 9,19 9.18,18.82 C24.1 10.2,18.17 v10.2,18.15 | C22.1 8.85,3.75 9.18,3.42 C25.1 v9.45,2.75
  Route2 0.152: 18.45,9.65 v18.45,9.75 | v18.45,9.75 18.45,9.85 | v18.45,9.75 17.25,10.95 17.25,12.4 17.25,13.1 | 17.25,13.1 17.25,13.5 | 17.25,13.1 16.65,13.7 16.65,14.55 16.65,15.3 17.65,15.3 17.7,15.35 | 19,15.35 19.6,14.75 20.85,13.5 20.85,12.8 20.85,12.05 | 20.85,12.05 20.85,9.9 20.7,9.75 19.9,8.95 v19.6,8.95 | v18.45,9.75 18.45,15.1 17.4,16.15 | 17.4,16.75 17.45,16.8 17.75,17.1 19.1,17.1 20.45,15.75 20.45,14.7 20.45,12.45 20.85,12.05
  Route2 0.305: 17.4,16.15 17.4,16.75
  pour Route2: 16.99,14.06 16.97,14.08 16.97,17.32 16.99,17.34 22.72,23.08 22.72,29.48 0.59,0.73 10.62,0.73 11.72,1.83 11.72,7.32 11.74,7.34 13.06,8.66 13.08,8.68 18.17,8.68 19.47,9.98 19.47,13.32 17.73,13.32 17.71,13.34
  pour Route2: 18.29,8.24 18.27,8.22 13.28,8.22 13.26,8.24 13.25,8.24 12.08,7.07 12.08,0.73 22.72,0.73 22.72,0.73 22.72,21.72 21.83,21.72 18.78,18.67 18.78,13.58 19.67,13.58 19.69,13.56 19.71,13.54 19.73,13.52 19.73,9.68 19.71,9.66
  pour Route2: 17.03,15.28 17.47,15.28 17.47,15.28 17.47,15.32 17.47,15.32 17.03,15.32 17.03,15.32 17.03,15.28
  pour Route2: 17.28,16.53 18.57,16.53 18.57,18.47 17.28,17.17
  pour Route2: 17.13,13.43 18.47,13.43 18.47,16.22 17.13,16.22 17.13,13.43
  pour Route2: 0.54,0.73 1.71,0.73 22.33,28.28 22.56,29.57 22.5,29.57 0.38,29.57 0.38,1.14 0.39,1.01 0.42,0.9 0.48,0.8
I_OUT1
  Top 0.152: R10.1 5.7,26.33 5.7,27.55 5.7,27.85 U7.4
I_OUT2
  Top 0.152: R27.1 6.19,18.26 U8.4
I_OUT3
  Top 0.152: R2.1 4.87,11.97 6.25,13.35 6.27,13.37 U5.4
I_OUT4
  Top 0.152: R4.1 6.22,3.95 U6.4
I_SET1
  Top 0.152: R9.1 6.22,25.84 U7.5
I_SET2
  Top 0.152: R26.1 6.03,16.03 U8.5
I_SET3
  Top 0.152: R1.1 5.21,10.85 U5.5
I_SET4
  Top 0.152: R3.1 6.17,1.63 U6.5
N$1
  Top 0.152: U6.8 9.64,1.63 L1.1
N$17
  Top 0.152: U4.1 17.47,22.09 C2.2
N$29
  Top 0.152: R21.2 2.09,26.88 J3.2
N$34
  Top 0.152: J4.2 2.08,20.27 R22.2
N$35
  Top 0.152: R28.2 4.33,13.1 J1.2
N$36
  Top 0.152: J2.2 3.81,6.17 R29.2
N$38
  Top 0.152: R34.2 13.99,9.4 L.2
N$39
  Top 0.152: R34.1 13.46,9.66 12.82,10.3 D1.A
N$40
  Top 0.152: U5.8 9.19,11.91 L2.1
N$41
  Top 0.152: L3.1 8.97,15.25 U8.8
OUT_A1
  Top 0.152: U1.1 9.03,25.21 R13.2 11.45,23.69 11.45,22.86 13.13,21.17 13.14,21.17 14.08,20.23 15.37,20.23 15.83,19.77 R15.1
OUT_A2
  Top 0.152: U2.1 9.84,9.97 R7.2 10.05,10.2 10.82,10.97 10.82,16.5 R23.1
OUT_B1
  Top 0.152: U1.7 7.72,20.26 7.72,20.87 7.89,21.04 8.3,21.04 9.06,21.04 10.42,19.68 R14.2 10.82,19.69 R16.1
OUT_B2
  Top 0.152: R24.1 11.3,7.5 11.75,7.05 11.75,4.57 R8.2 10.57,3.63 9.8,4.4 9.8,5.35 8.38,6.77 8.38,7.08 8.07,7.4 7.63,7.4 7.32,7.08 7.32,6.64 7.55,6.41 U2.7
REFIN1(+)
  Top 0.152: R25.1 13.09,13.91 13.85,14.67 U3.12
REFIN1(-)
  Top 0.152: U3.23 17.91,10.93 C13.1 | C13.1 17.72,9.95 C14.1 | C13.1 17.59,10.87 17.59,11.04 17.33,11.3 11.9,11.3 11.7,11.5 11.7,12.45 12,12.75 12.35,12.75 12.39,12.75 12.79,13.15 12.86,13.22 13.07,13.22 13.57,13.72 13.57,13.89 13.64,13.96 13.71,14.03 14.06,14.03 U3.13
REGCAPA
  Top 0.152: U3.24 18.45,11.93 C19.1
REGCAPD
  Top 0.152: U3.1 18.74,17.2 18.89,17.2 19.19,17.5 C18.1
SCLK
  Top 0.152: U3.30 19.64,15.17 19.79,15.02 21.09,15.02 21.6,14.5 21.6,7.63 20.54,6.57 arc-90 20.39,6.57 arc90 20.23,6.57 20.01,6.35 arc90 20.01,6.19 arc-90 20.01,6.04 19.9,5.93 arc-90 19.74,5.93 arc90 19.59,5.93 19.37,5.7 arc90 19.37,5.55 19.52,5.4 arc-90 19.52,5.25 19.3,5.02 arc-90 19.14,5.02 18.99,5.17 arc90 18.84,5.17 18.61,4.95 arc90 18.61,4.8 18.77,4.64 arc-90 18.77,4.49 18.54,4.27 arc-90 18.39,4.27 arc90 18.24,4.27 17.96,3.99 JP1.2
SYNC
  Top 0.152: U3.27 19.91,13.67 R31.1
V_REF  (via drill 0.2, 0.3)
  Top 0.152: U4.5 15.53,22.97 16,22.5 16.05,22.45 v16.05,20.8 16.67,20.18 R17.2 | v14.71,20.82 14.91,21.01 U4.6 14.49,21.6 C1.1 | R18.2 14.07,19.81 13.29,20.59 v12.59,20.59 | R19.2 11.79,18.96 v11.65,19.1 | C15.1 13.15,12.15 12.95,11.95 v12.45,11.95 | R20.2 11.35,15.7 v11.35,16.2 | R25.2 12,13.42 v12,13.3
  Top 0.406: R17.2 18.83,20.18 18.9,20.25 20.8,22.15 20.8,23.3 20.8,24.75 19.85,25.7 19.03,26.52 J7.1
  Route15 0.152: 11.22,14.75 11.22,14.87 11.32,14.98
  pour Route15: 17.52,17.88 17.52,21.17 16.13,21.17 16.11,21.19 16.09,21.21 16.07,21.23 16.07,23.17 11.18,23.17 11.18,11.83 11.18,11.83 13.27,11.83 13.52,12.08 13.52,14.82 13.54,14.84 13.66,14.96 13.68,14.98 14.47,14.98 14.62,15.13 14.62,16.32 14.64,16.34 14.71,16.41 14.73,16.43 17.17,16.43 17.17,16.43 17.17,17.52 17.19,17.54

### Text on the board
tPlace: 3V3 | GND | VREF | 1 | SNEL | 2 | 3 | 4 | LED | POCI | PICO | SCLK | CS
bPlace: Sensorimotor Neural / Engineering Lab | Kinematics Tracking Wearable / Signal Acquisition Board